# Altium schematic sheet Nestling_2.1_EXB_POWER.SchDoc
size A4
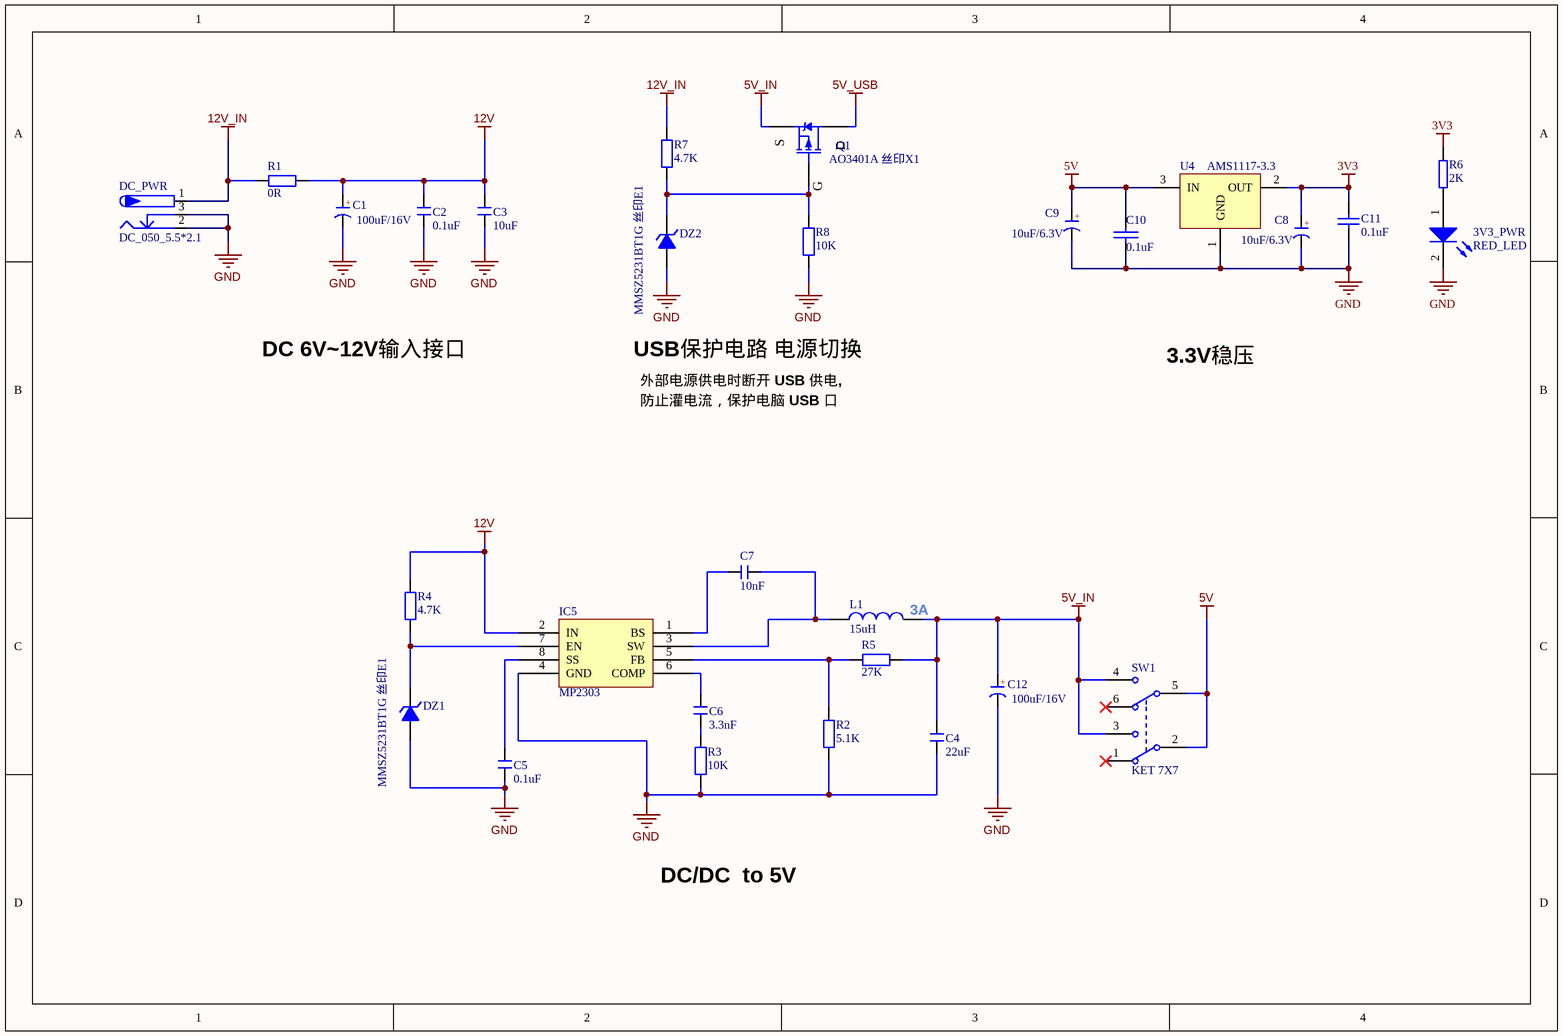
[diagram p0: Nestling_2.1_EXB_POWER.SchDoc]

## Parts
3V3_PWR  RED_LED  [LED 0603R]
C1  100uF/16V  [CM D(6.3*5.4)]
C2  0.1uF  [C 0603_M]
C3  10uF  [C 0603_M]
C4  22uF  [C 0603_M]
C5  0.1uF  [C 0603_M]
C6  3.3nF  [C 0603_M]
C7  10nF  [C 0603_M]
C8  10uF/6.3V  [CD S(2012)]
C9  10uF/6.3V  [CD S(2012)]
C10  0.1uF  [C 0603_M]
C11  0.1uF  [C 0603_M]
C12  100uF/16V  [CM D(6.3*5.4)]
DC_PWR  DC_050_5.5*2.1  [DC-050]
DZ1  MMSZ5231BT1G 丝印E1  [SOD-123]
DZ2  MMSZ5231BT1G 丝印E1  [SOD-123]
IC5  MP2303  [SOP8_N]
L1  15uH  [L-SMD-0630]
Q1  AO3401A 丝印X1  [SOT23-3N]
R1  0R  [R 0603_M]
R2  5.1K  [R 0603_M]
R3  10K  [R 0603_M]
R4  4.7K  [R 0603_M]
R5  27K  [R 0603_M]
R6  2K  [R 0603_M]
R7  4.7K  [R 0603_M]
R8  10K  [R 0603_M]
SW1  KET 7X7  [KFT DIP-7X7]
U4  AMS1117-3.3  [SOT223_N]

## Nets
3V3: C8.1(A) C11.1 R6.2 U4.2(OUT)
5V: C9.1(A) C10.1 SW1.2(COM2) SW1.5(COM2) U4.3(IN)
5V_IN: C4.2 C12.1(A) L1.2 Q1.2(S) R5.1 SW1.3(NO1) SW1.4(NO2)
5V_USB: Q1.3(D)
12V: C1.1(A) C2.2 C3.2 IC5.2(IN) R1.2 R4.2
12V_IN: DC_PWR.1 R1.1 R7.2
GND: 3V3_PWR.2(K) C1.2(K) C2.1 C3.1 C4.1 C5.1 C8.2(K) C9.2(K) C10.2 C11.2 C12.2(K) DC_PWR.2 DC_PWR.3 DZ1.1(A) DZ2.1(A) IC5.4(GND) R2.1 R3.1 R8.1 U4.1(GND)
Net3V3_PWR_1: 3V3_PWR.1(A) R6.1
NetC5_2: C5.2 IC5.8(SS)
NetC6_1: C6.1 R3.2
NetC6_2: C6.2 IC5.6(COMP)
NetC7_1: C7.1 IC5.3(SW) L1.1
NetC7_2: C7.2 IC5.1(BS)
NetDZ1_2: DZ1.2(K) IC5.7(EN) R4.1
NetDZ2_2: DZ2.2(K) Q1.1(G) R7.1 R8.2
NetIC5_5: IC5.5(FB) R2.2 R5.2

Not connected (* = marked no-connect by the designer): SW1 1(NC1)* 6(NC2)*

## Notes on the sheet
- DC 6V~12V输入接口
- USB保护电路 电源切换
- 外部电源供电时断开 USB 供电,
- 3.3V稳压
- 防止灌电流，保护电脑 USB 口
- (near L1) 3A
- DC/DC  to 5V
- (in symbol C-CD) +
- (in symbol C-CM) +

## Library data of the parts
3V3_PWR = LED0: Typical INFRARED GaAs LED
C1 C12 = C-CM: 贴片电解电容; 版权归属: 源创客; BOM名称: 贴片电解电容; 学习资源: www.ooocke.com
C2-C7 = C: 无极性贴片电容; 版权归属: 源创客; BOM名称: 无极性贴片电容; 学习资源: www.ooocke.com
C8 C9 = C-CD: 贴片钽电容; 版权归属: 源创客; BOM名称: 贴片钽电容; 学习资源: www.ooocke.com
C10 = CAP: Capacitor
C11 = Cap: Capacitor; Published: 8-Jun-2000; LatestRevisionDate: 17-Jul-2002; LatestRevisionNote: Re-released for DXP Platform.; PackageReference: RAD-0.3; Publisher: Altium Limited
DC_PWR = P-DC: 低压电源接口; BOM名称: DC电源接口; 版权归属: 源创客; 学习资源: www.ooocke.com
DZ1 DZ2 = 1N4625: 5.1V/0.5W稳压管; 版权归属: 源创客; BOM名称: 5.1V/0.5W稳压管; 学习资源: www.ooocke.com
L1 = L: 小功率贴片电感; 版权归属: 源创客; BOM名称: 小功率贴片电感; 学习资源: www.ooocke.com
Q1 = SI2301: P沟道场效应管; 版权归属: 源创客; BOM名称: P沟道场效应管; 学习资源: www.ooocke.com
R1-R5 R7 R8 = R: 贴片电阻; 版权归属: 源创客; BOM名称: 贴片电阻; 学习资源: www.ooocke.com
R6 = R
SW1 = KET 7X7: 7*7自锁开关; 版权归属: 源创客; BOM名称: 7*7自锁开关; 学习资源: www.ooocke.com
U4 = LT1085CM-3.3